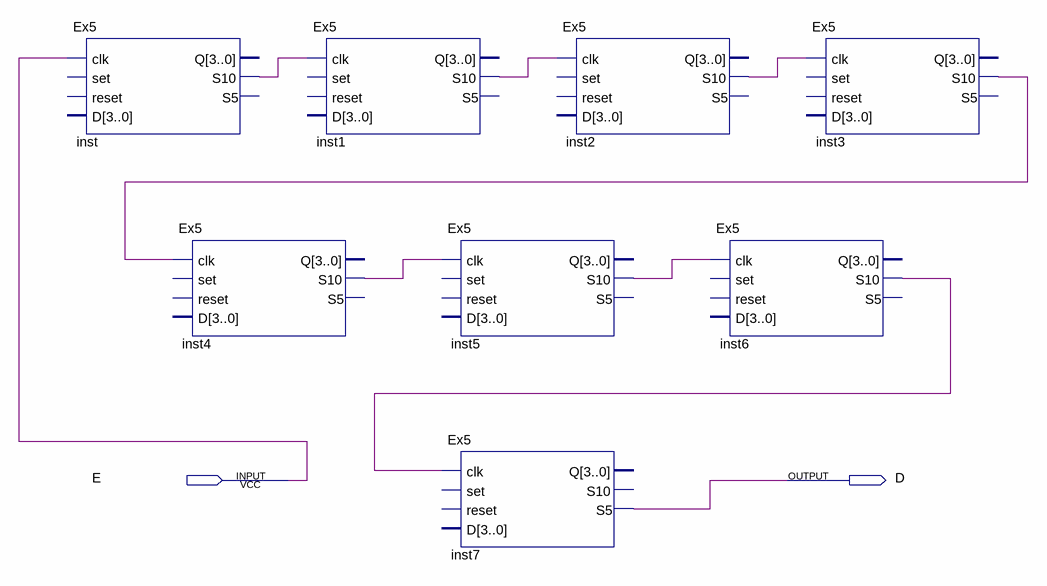
[diagram p0: schematic sheet]
// Quartus schematic Ex5_SCHEME.bdf as structural Verilog: 8 symbols, 2 pins
module Ex5_SCHEME (
  input  E,
  output D
);

  wire inst1_s10, inst2_s10, inst3_s10, inst4_s10, inst5_s10, inst6_s10, inst_s10;

  Ex5 inst (.clk(E), .S10(inst_s10));  // open: set, reset, D, Q, S5
  Ex5 inst4 (.clk(inst3_s10), .S10(inst4_s10));  // open: set, reset, D, Q, S5
  Ex5 inst1 (.clk(inst_s10), .S10(inst1_s10));  // open: set, reset, D, Q, S5
  Ex5 inst5 (.clk(inst4_s10), .S10(inst5_s10));  // open: set, reset, D, Q, S5
  Ex5 inst7 (.clk(inst6_s10), .S5(D));  // open: set, reset, D, Q, S10
  Ex5 inst2 (.clk(inst1_s10), .S10(inst2_s10));  // open: set, reset, D, Q, S5
  Ex5 inst6 (.clk(inst5_s10), .S10(inst6_s10));  // open: set, reset, D, Q, S5
  Ex5 inst3 (.clk(inst2_s10), .S10(inst3_s10));  // open: set, reset, D, Q, S5
endmodule
